# EAGLE schematic Telemetry Transceiver Board (EAGLE 8.4.1)
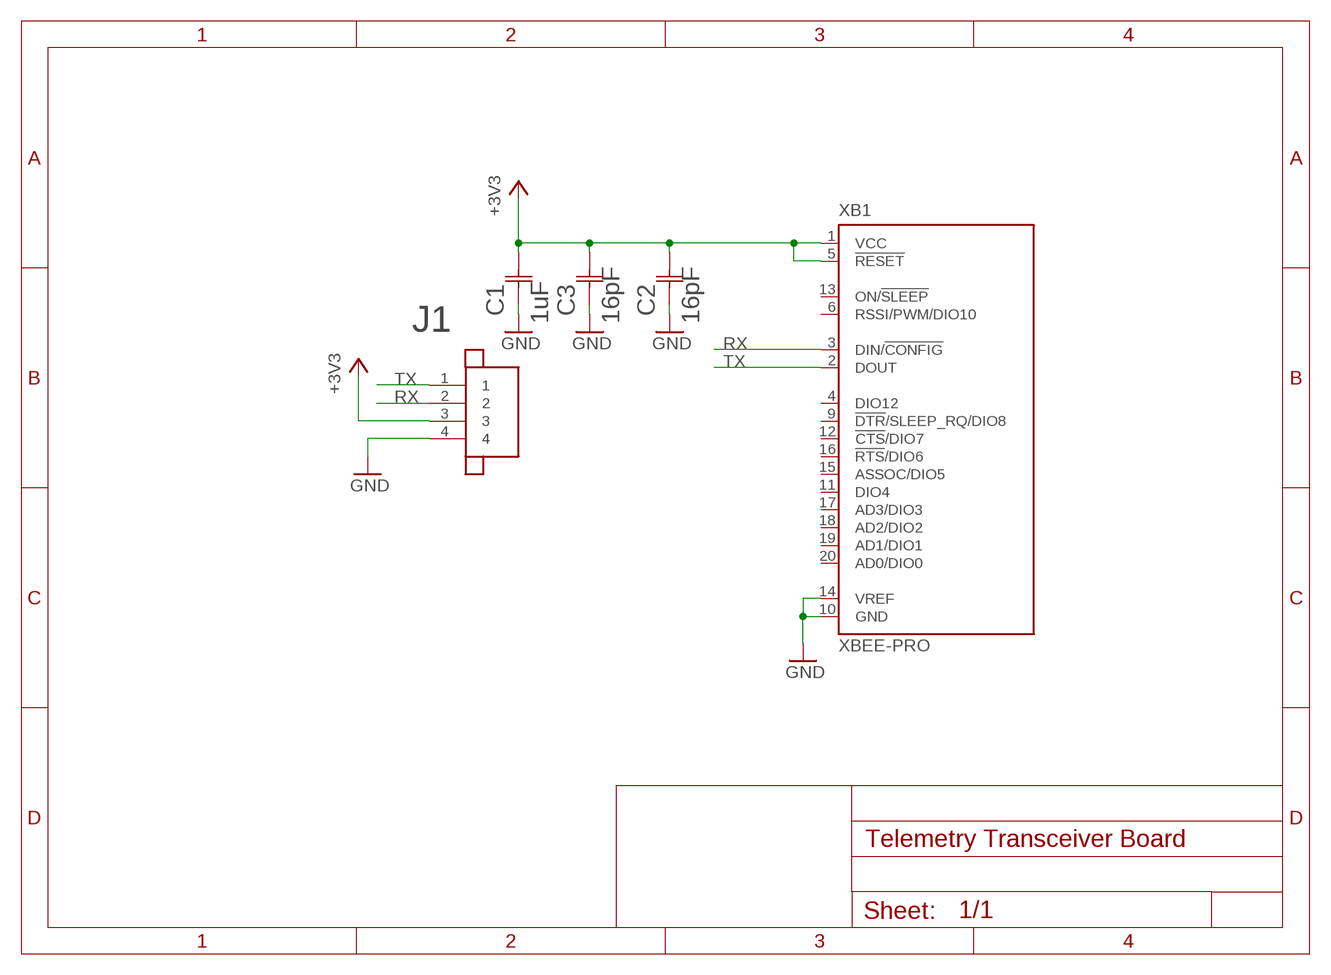
[diagram p0: schematic, sheet 1]

## Parts
C1  1uF  CC0805KKX7R7BB105  [YAG_CC0805]
C2  16pF  GRM1555C1H160JA01DG-155-M  [G-155-M]
C3  16pF  GRM1555C1H160JA01DG-155-M  [G-155-M]
J1  JST_SH_4POS  [JST_SH_4POS]
XB1  XBEE-PRO  [XBEE-PRO]

## Nets
+3V3: C1.2 C2.2 C3.2 J1.3 XB1.1(VCC) XB1.5(!RESET)
GND: C1.1 C2.1 C3.1 J1.4 XB1.10(GND) XB1.14(VREF)
RX: J1.2 XB1.3(DIN/!CONFIG)
TX: J1.1 XB1.2(DOUT)
Unconnected: XB1.4(DIO12) XB1.6(RSSI/PWM/DIO10) XB1.9(!DTR!/SLEEP_RQ/DIO8) XB1.11(DIO4) XB1.12(!CTS!/DIO7) XB1.13(ON/!SLEEP) XB1.15(ASSOC/DIO5) XB1.16(!RTS!/DIO6) XB1.17(AD3/DIO3) XB1.18(AD2/DIO2) XB1.19(AD1/DIO1) XB1.20(AD0/DIO0)

## Library data of the parts
C1 = Telemetry Transceiver Board:CC0805KKX7R7BB105; COPYRIGHT: Copyright C 2015 Accelerated Designs. All rights reserved; MANUFACTURER_PART_NUMBER: CC0805KKX7R7BB105; VENDOR: Vendor
C2 C3 = Telemetry Transceiver Board:GRM1555C1H160JA01D; MANUFACTURER_PART_NUMBER: GRM1555C1H160JA01D; VENDOR: Murata
J1 = thanics_robotics:JST_SH_4POS
XB1 = xbee:XBEE: XBee (TM) /XBee-PRO(TM) OEM RF Modules Source: MaxStream, Inc. xbee_productmanual.pdf; MPN: XBP24-AWI-001; OC_FARNELL: 1337916; OC_NEWARK: 42M2667